# EAGLE design nanino (EAGLE 6.2)
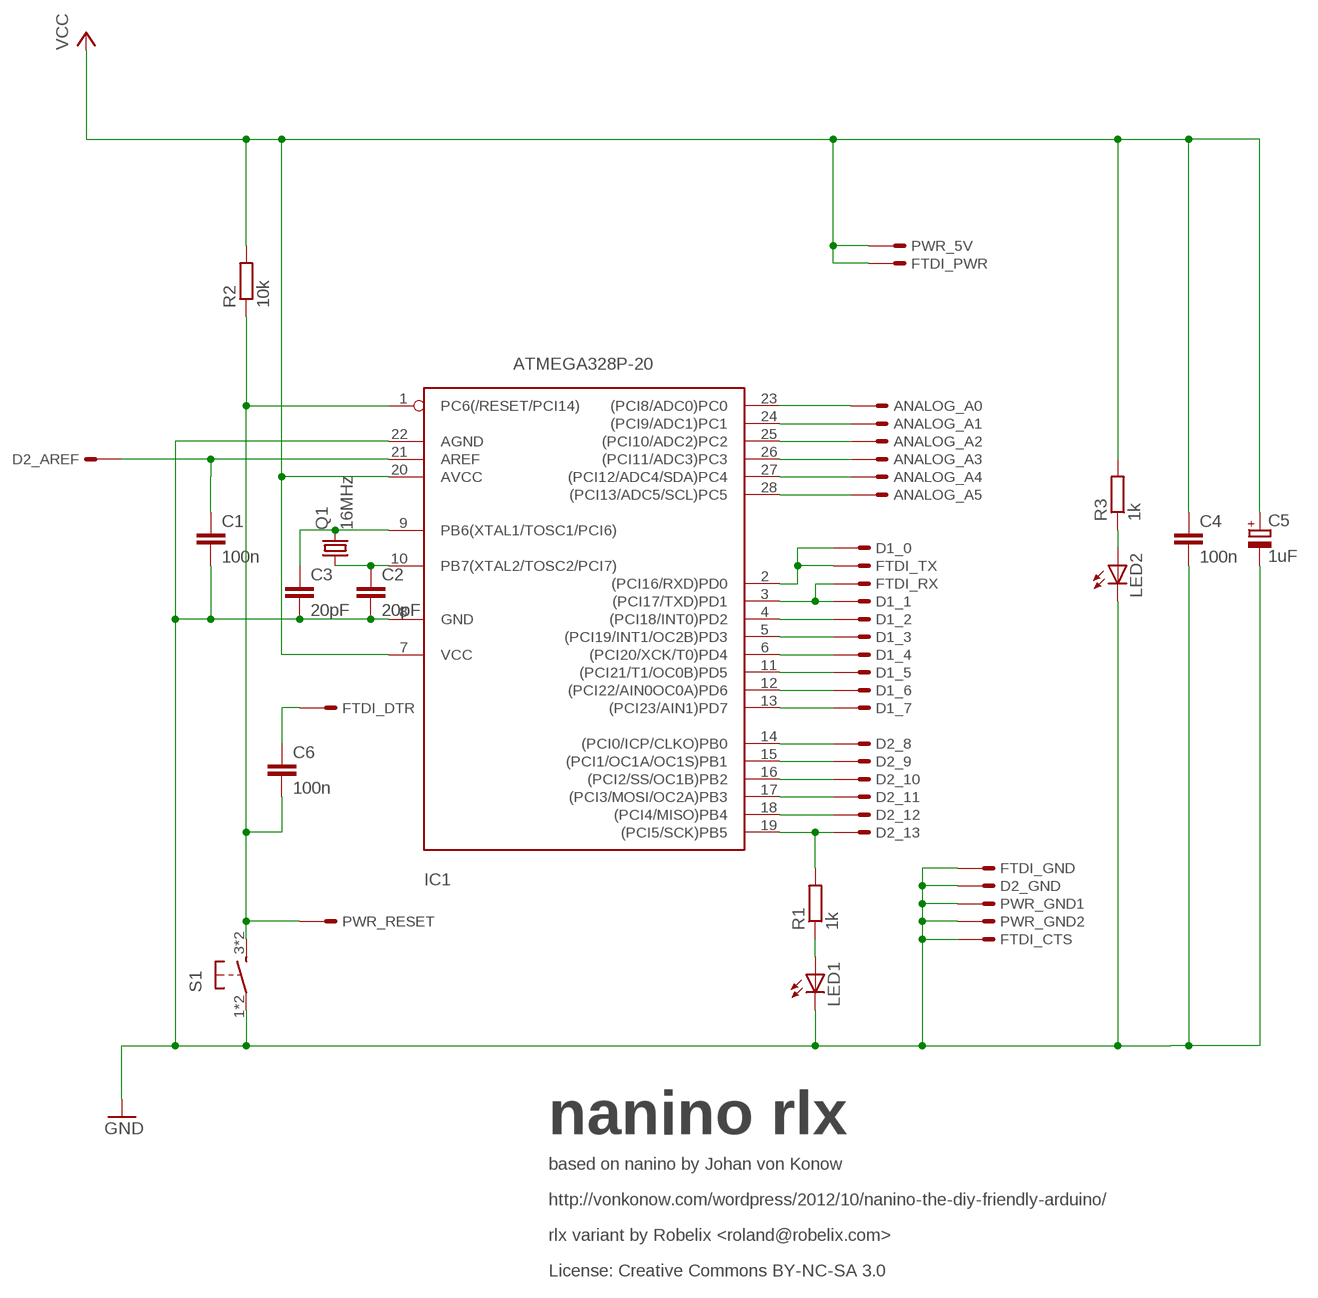
[diagram p0: schematic, sheet 1]

## Parts
ANALOG_  PINS_ARDUINO_ANALOG1  [6PIN]
C1  100n  C-EU025-025X050  [C025-025X050]
C2  20pF  C-EU025-025X050  [C025-025X050]
C3  20pF  C-EU025-025X050  [C025-025X050]
C4  100n  C-EU025-025X050  [C025-025X050]
C5  1uF  CPOL-EUE2.5-5-L-12  [E2,5-5-L-12]
C6  100n  C-EU050-025X075  [C050-025X075]
D1_  PINS_ARDUINO_DIGITAL1  [8PIN]
D2_  PINS_ARDUINO_DIGITAL2  [8PIN]
FTDI_  PINS_FTDI1  [6PIN]
IC1  ATMEGA328P-20  [DIL28-3]
LED1  LED3MM  [LED3MM]
LED2  LED3MM  [LED3MM]
PWR_  PINS_ARDUINO_PWR1  [6PIN]
Q1  16MHz  CRYSTALHC49U-V  [HC49U-V]
R1  1k  R-EU_0207/10  [0207/10]
R2  10k  R-EU_0207/10  [0207/10]
R3  1k  R-EU_0207/10  [0207/10]
S1  TASTER4.3MM  [TASTER6X6]

## Nets
GND: C1.2 C2.2 C3.2 C4.2 C5.- D2_.7 FTDI_.1 FTDI_.2 IC1.8(GND) IC1.22(AGND) LED1.K(C) LED2.K(C) PWR_.4 PWR_.5 S1.1 S1.2
N$1: D1_.1 FTDI_.4 IC1.2((PCI16/RXD)PD0)
N$2: D1_.2 FTDI_.5 IC1.3((PCI17/TXD)PD1)
N$3: D1_.3 IC1.4((PCI18/INT0)PD2)
N$4: D1_.4 IC1.5((PCI19/INT1/OC2B)PD3)
N$5: D1_.5 IC1.6((PCI20/XCK/T0)PD4)
N$6: D1_.6 IC1.11((PCI21/T1/OC0B)PD5)
N$7: D1_.7 IC1.12((PCI22/AIN0OC0A)PD6)
N$8: D1_.8 IC1.13((PCI23/AIN1)PD7)
N$9: D2_.1 IC1.14((PCI0/ICP/CLKO)PB0)
N$10: D2_.2 IC1.15((PCI1/OC1A/OC1S)PB1)
N$11: D2_.3 IC1.16((PCI2/SS/OC1B)PB2)
N$12: D2_.4 IC1.17((PCI3/MOSI/OC2A)PB3)
N$13: D2_.5 IC1.18((PCI4/MISO)PB4)
N$14: D2_.6 IC1.19((PCI5/SCK)PB5) R1.2
N$15: LED1.A R1.1
N$17: ANALOG_.6 IC1.23((PCI8/ADC0)PC0)
N$18: ANALOG_.5 IC1.24((PCI9/ADC1)PC1)
N$19: ANALOG_.4 IC1.25((PCI10/ADC2)PC2)
N$20: ANALOG_.3 IC1.26((PCI11/ADC3)PC3)
N$21: ANALOG_.2 IC1.27((PCI12/ADC4/SDA)PC4)
N$22: ANALOG_.1 IC1.28((PCI13/ADC5/SCL)PC5)
N$24: C6.2 IC1.1(PC6(/RESET/PCI14)) PWR_.1 R2.1 S1.3 S1.4
N$25: LED2.A R3.1
N$28: C1.1 D2_.8 IC1.21(AREF)
N$29: C3.1 IC1.9(PB6(XTAL1/TOSC1/PCI6)) Q1.2
N$30: C2.1 IC1.10(PB7(XTAL2/TOSC2/PCI7)) Q1.1
N$33: C6.1 FTDI_.6
VCC: C4.1 C5.+ FTDI_.3 IC1.7(VCC) IC1.20(AVCC) PWR_.3 R2.2 R3.2
Unconnected: PWR_.2 PWR_.6

## Notes on the sheet
- nanino rlx
- based on nanino by Johan von Konow
- http://vonkonow.com/wordpress/2012/10/nanino-the-diy-friendly-arduino/
- rlx variant by Robelix <roland@robelix.com>
- License: Creative Commons BY-NC-SA 3.0

## Library data of the parts
ANALOG_ = arduino:PINS_ARDUINO_ANALOG
C1-C4 C6 = rc:C-EU: CAPACITOR, European symbol
C5 = elkos:CPOL-EU: POLARIZED CAPACITOR, European symbol
D1_ = arduino:PINS_ARDUINO_DIGITAL1
D2_ = arduino:PINS_ARDUINO_DIGITAL2
FTDI_ = arduino:PINS_FTDI
IC1 = atmel:ATMEGA328P
LED1 LED2 = leds:LED: LED OSRAM: - CHIPLED LG R971, LG N971, LY N971, LG Q971, LY Q971, LO R971, LY R971 LH N974, LH R974 LS Q976, LO Q976, LY Q976 LO Q996 - Hyper CHIPLED LW Q18S LB Q993, LB Q99A, LB R99A - SideLED LS A670, LO A670, LY A670, LG A670, LP A670 LB A673, LV A673, LT A673, LW A673 LH A674 LY A675 LS A676, LA A676, LO A676, LY A676, LW A676 LS A679, LY A679, LG A679 - Hyper Micro SIDELED® LS Y876, LA Y876, LO Y876, LY Y876 LT Y87S - SmartLED LW L88C, LW L88S LB L89C, LB L89S, LG L890 LS L89K, LO L89K, LY L89K LS L896, LA L896, LO L896, LY L896 - TOPLED LS T670, LO T670, LY T670, LG T670, LP T670 LSG T670, LSP T670, LSY T670, LOP T670, LYG T670 LG T671, LOG T671, LSG T671 LB T673, LV T673, LT T673, LW T673 LH T674 LS T676, LA T676, LO T676, LY T676, LB T676, LH T676, LSB T676, LW T676 LB T67C, LV T67C, LT T67C, LS T67K, LO T67K, LY T67K, LW E67C LS E67B, LA E67B, LO E67B, LY E67B, LB E67C, LV E67C, LT E67C LW T67C LS T679, LY T679, LG T679 LS T770, LO T770, LY T770, LG T770, LP T770 LB T773, LV T773, LT T773, LW T773 LH T774 LS E675, LA E675, LY E675, LS T675 LS T776, LA T776, LO T776, LY T776, LB T776 LHGB T686 LT T68C, LB T68C - Hyper Mini TOPLED® LB M676 - Mini TOPLED Santana® LG M470 LS M47K, LO M47K, LY M47K Source: http://www.osram.convergy.de LUXEON: - LUMILED® LXK2-PW12-R00, LXK2-PW12-S00, LXK2-PW14-U00, LXK2-PW14-V00 LXK2-PM12-R00, LXK2-PM12-S00, LXK2-PM14-U00 LXK2-PE12-Q00, LXK2-PE12-R00, LXK2-PE12-S00, LXK2-PE14-T00, LXK2-PE14-U00 LXK2-PB12-K00, LXK2-PB12-L00, LXK2-PB12-M00, LXK2-PB14-N00, LXK2-PB14-P00, LXK2-PB14-Q00 LXK2-PR12-L00, LXK2-PR12-M00, LXK2-PR14-Q00, LXK2-PR14-R00 LXK2-PD12-Q00, LXK2-PD12-R00, LXK2-PD12-S00 LXK2-PH12-R00, LXK2-PH12-S00 LXK2-PL12-P00, LXK2-PL12-Q00, LXK2-PL12-R00 Source: www.luxeon.com KINGBRIGHT: KA-3528ASYC Source: www.kingbright.com
PWR_ = arduino:PINS_ARDUINO_PWR
Q1 = crystals:CRYSTAL: CRYSTAL; OC_FARNELL: 1666969; OC_NEWARK: unknown
R1-R3 = rc:R-EU_: RESISTOR, European symbol
S1 = switch:TASTER: Kurzhubtaster vertikale Betätigung, 6x6 mm; REICHELT: TASTER 3301

## Board
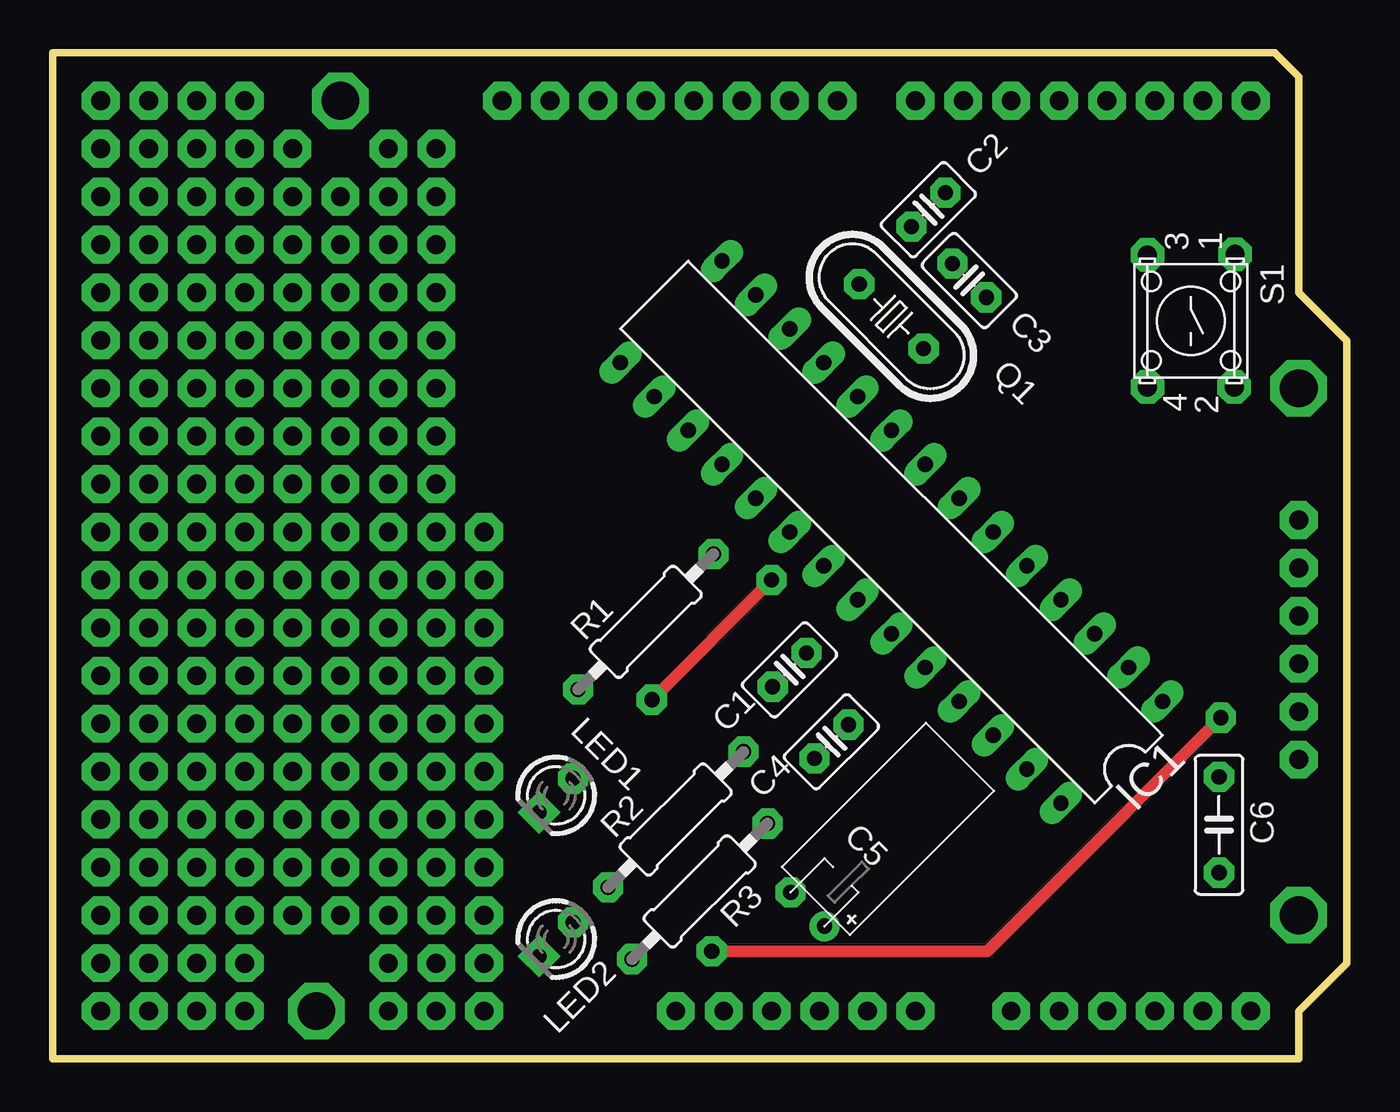
[diagram p1: board, top side]
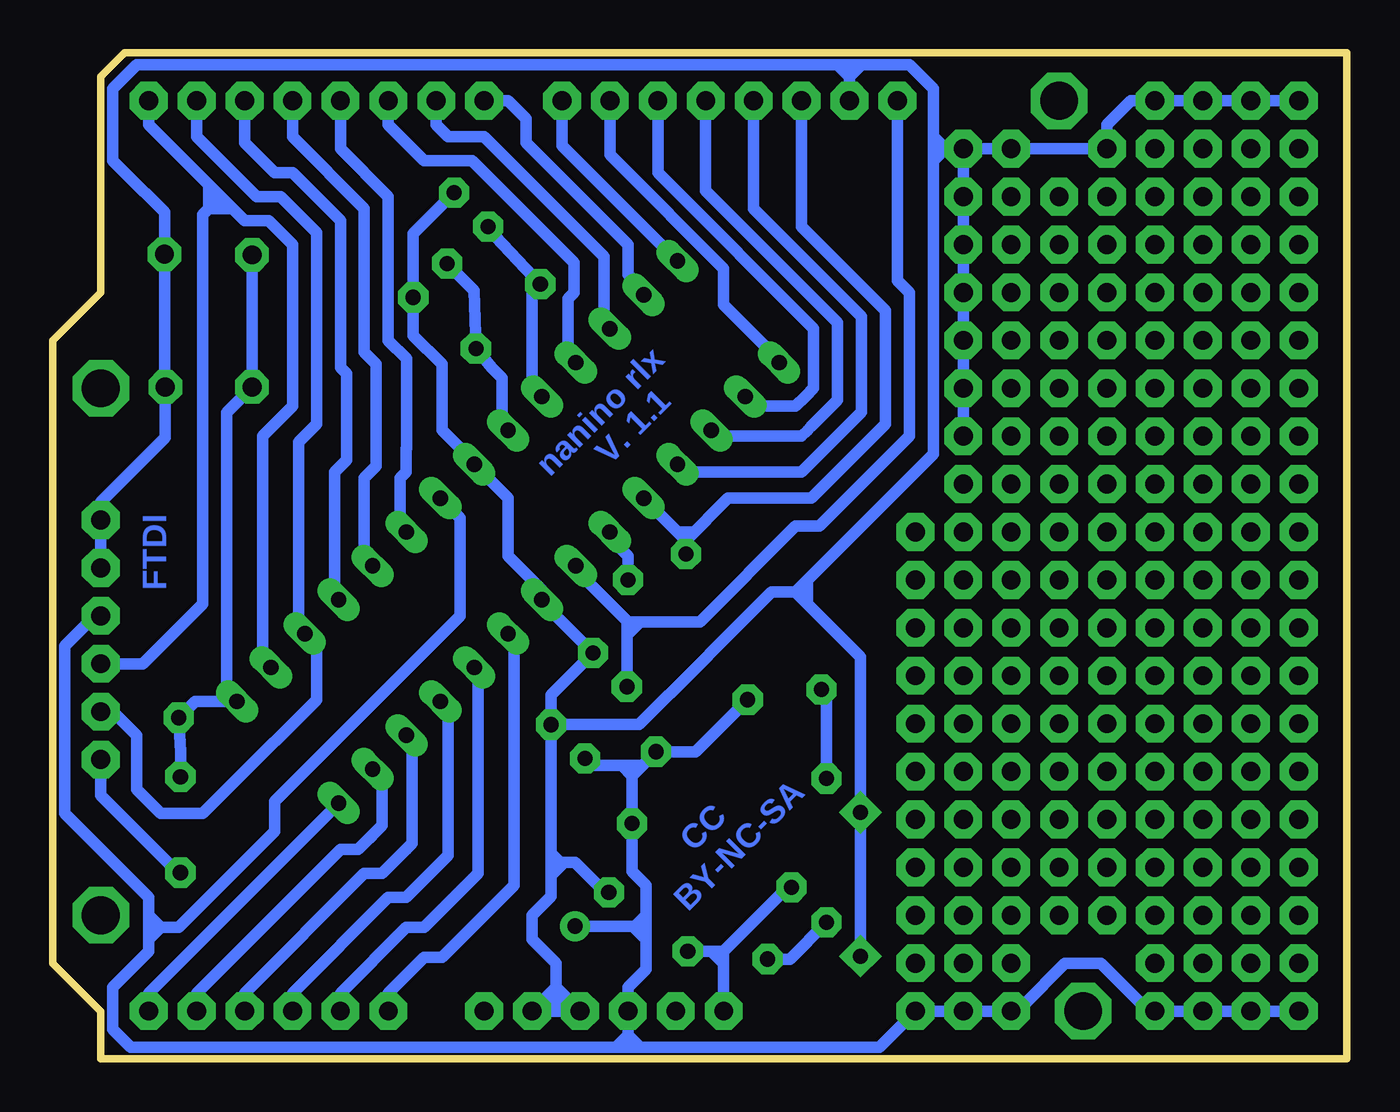
[diagram p2: board, bottom side, seen from below]

Size 68.58 x 53.34 mm. Coordinates in mm from the lower left corner, seen from the top.
Outline: 0,53.34 0,0 66.04,0 66.04,2.54 68.58,5.08 68.58,38.1 66.04,40.64 66.04,52.07 64.77,53.34 0,53.34
Copper layers (1*16): Top 0.035mm / dielectric 1.5mm / Bottom 0.035mm
Design rules "default": minimum track width 10mil, minimum drill 24mil, track to track 8mil, track to pad 8mil, pad to pad 8mil, via to via 8mil, smd to smd 8mil, copper to edge 40mil, drill to drill 8mil, minimum pad ring 10mil, minimum via ring 8mil, stop-mask expansion 4mil, vias tented up to drill 0mil, thermal gap 10mil

### Footprints (pad centres in the part's own frame; a part is rotated, then mirrored left to right if it is on the bottom)
6PIN = drill 1 pad 2 octagon: 1 -6.35,-1.27; 2 -3.81,-1.27; 3 -1.27,-1.27; 4 1.27,-1.27; 5 3.81,-1.27; 6 6.35,-1.27
C025-025X050 = drill 0.8 pad 1.6 octagon: 1 -1.27,0; 2 1.27,0
E2,5-5-L-12 = drill 0.813 pad 1.6: + -1.27,0 | drill 0.813 pad 1.6 octagon: - 1.27,0
C050-025X075 = drill 0.8 pad 1.6 octagon: 1 -2.54,0; 2 2.54,0
8PIN = drill 1 pad 2 octagon: 1 -8.89,-1.27; 2 -6.35,-1.27; 3 -3.81,-1.27; 4 -1.27,-1.27; 5 1.27,-1.27; 6 3.81,-1.27; 7 6.35,-1.27; 8 8.89,-1.27
DIL28-3 = drill 0.813 long: 1 -16.51,-3.81; 2 -13.97,-3.81; 3 -11.43,-3.81; 4 -8.89,-3.81; 5 -6.35,-3.81; 6 -3.81,-3.81; 7 -1.27,-3.81; 8 1.27,-3.81; 9 3.81,-3.81; 10 6.35,-3.81; 11 8.89,-3.81; 12 11.43,-3.81; 13 13.97,-3.81; 14 16.51,-3.81; 15 16.51,3.81; 16 13.97,3.81; 17 11.43,3.81; 18 8.89,3.81; 19 6.35,3.81; 20 3.81,3.81; 21 1.27,3.81; 22 -1.27,3.81; 23 -3.81,3.81; 24 -6.35,3.81; 25 -8.89,3.81; 26 -11.43,3.81; 27 -13.97,3.81; 28 -16.51,3.81
LED3MM = drill 0.8 pad 1.6 octagon: A -1.27,0 | drill 0.8 pad 1.6 square: K 1.27,0
HC49U-V = drill 0.8 pad 1.6 octagon: 1 -2.413,0; 2 2.413,0
0207/10 = drill 0.8 pad 1.6 octagon: 1 -5.08,0; 2 5.08,0
TASTER6X6 = drill 1 pad 1.778 octagon: 1 -3.54,2.34; 2 3.5,2.3; 3 -3.5,-2.3; 4 3.5,-2.3

### Placement (x,y rotation side)
ANALOG_  57.15,1.27 180 top
C1  39.05,20.64 45 top
C2  46.41,45.03 45 top
C3  48.58,41.27 315 top
C4  41.27,16.83 45 top
C5  40.01,7.94 135 top
C6  61.82,12.42 90 top
D1_  54.61,49.53 180 top
D2_  32.7,49.53 180 top
FTDI_  67.31,22.23 270 top
IC1  44.45,27.94 135 top
LED1  26.67,13.97 225 top
LED2  26.67,6.35 225 top
PWR_  39.37,3.81 0 top
Q1  44.45,39.37 315 top
R1  31.43,23.18 45 top
R2  33.02,12.7 45 top
R3  34.29,8.89 45 top
S1  60.33,39.13 270 top

### Tracks (layer width: path | path; a pad name or v marks a point on that pad's centre or on a via)
GND  (via drill 1 pad 2)
  Bottom 0.61: LED2.K LED1.K 25.77,21.33 26.35,21.91 28.26,23.81 | 26.99,52.7 27.94,52.7 49.21,52.7 64.14,52.7 65.41,51.44 65.41,47.62 64.77,46.99 62.66,44.88 S1.1 62.66,35.67 S1.2 62.62,32.94 63.18,32.38 66.04,29.53 FTDI_.1 FTDI_.2 | 26.99,52.7 26.35,52.7 | 26.35,52.7 25.72,52.7 | 25.72,52.7 23.18,52.7 21.91,51.44 21.91,48.9 | 21.91,48.9 21.91,48.26 | 21.91,48.26 21.91,47.62 | 21.91,47.62 21.91,46.35 21.91,45.72 21.91,45.09 21.91,36.2 | 21.91,36.2 21.91,35.56 21.91,34.92 | 26.35,51.12 D2_.7 26.35,52.07 | 21.91,34.92 21.91,34.61 | 21.91,34.61 21.91,32.07 26.67,27.3 | C2.2 49.48,43.76 C3.2 49.48,38.68 49.48,38.36 47.94,36.83 47.94,33.34 47.62,33.02 46.67,32.07 46.25,31.64 IC1.8 44.45,29.74 44.45,26.67 42.65,24.87 IC1.22 42.65,24.24 C1.2 42.17,19.31 C4.2 | C4.2 37.52,17.73 34.29,20.95 33.34,21.91 30.48,24.77 29.21,24.77 | C4.2 42.17,10.42 | 28.26,23.81 28.57,24.13 | 28.57,24.13 29.21,24.77 | 26.35,52.07 26.35,52.7 | 26.35,52.7 25.72,52.7 | 25.72,52.7 26.35,52.07 | 26.35,52.07 26.99,52.7 | 26.99,26.99 26.67,27.3 | 28.26,23.81 28.57,24.13 | 28.57,24.13 29.21,24.77 | 26.67,27.3 28.57,25.4 | 28.57,25.4 29.21,24.77 | 28.57,24.13 28.57,25.08 28.57,25.4 | v20.32,35.56 v20.32,38.1 v20.32,40.64 v20.32,43.18 v20.32,45.72 | v2.54,50.8 v5.08,50.8 v7.62,50.8 v10.16,50.8 11.43,50.8 12.7,49.53 12.7,48.26 17.78,48.26 20.32,48.26 | 21.91,36.2 21.91,34.92 | 21.91,34.92 21.91,34.61 | 41.91,3.81 41.91,3.49 41.91,3.17 | 41.91,3.17 41.27,2.54 PWR_.4 | PWR_.4 42.55,2.54 | 42.55,2.54 PWR_.5 | 41.91,3.17 42.55,2.54 | 42.55,2.54 42.55,2.86 42.86,3.17 42.55,3.17 | 42.55,3.17 40.96,3.17 40.96,2.86 PWR_.4 | PWR_.4 41.91,3.81 | 41.91,3.81 42.55,3.17
  Bottom 0.61: v20.32,35.56 v20.32,45.72 | v20.32,33.02 v20.32,35.56 | v20.32,45.72 20.32,48.26 | v20.32,45.72 20.32,48.26 | 20.32,48.26 21.27,48.26 | 21.27,48.26 21.91,48.26 | 21.91,48.9 21.27,48.26 | 21.27,48.26 21.91,47.62 | C5.- 39.32,8.84 40.64,10.16 40.9,10.42 42.17,10.42 | 41.91,3.81 41.91,5.08 43.18,6.35 43.18,7.62 42.17,8.63 42.17,9.15 42.17,10.42
N$1
  Bottom 0.61: 56.52,43.81 57.15,44.45 | 57.15,44.45 55.88,43.18 55.88,34.61 57.47,33.02 57.47,32.7 57.47,21.59 57.47,21.27 57.02,20.83 IC1.2 | 60.33,45.09 60.64,44.77 60.64,38.42 60.64,29.84 60.64,25.72 60.64,24.13 63.82,20.95 65.41,20.95 FTDI_.4 | 60.33,45.09 59.69,45.72 | D1_.1 63.5,49.85 63.5,49.53 60.33,46.35 | 60.33,46.35 59.69,45.72 | 59.69,45.72 59.05,45.09 | 59.05,45.09 58.74,44.77 58.42,44.45 57.15,44.45 | 59.05,45.09 60.33,45.09 | 60.33,45.09 60.33,46.35
N$2
  Bottom 0.61: D1_.2 60.96,49.85 60.96,48.9 57.78,45.72 56.52,45.72 54.61,43.81 54.61,33.66 55.56,32.7 55.56,23.18 55.23,22.84 IC1.3 55.57,22.55 54.61,21.59 54.61,19.05 59.05,14.61 60.33,13.34 60.64,13.02 62.87,13.02 | FTDI_.5 65.41,18.41 64.77,17.78 64.45,17.46 64.14,17.14 64.14,14.29 | 64.14,14.29 62.87,13.02 | 62.87,13.02 64.14,14.29
N$3
  Bottom 0.61: IC1.4 53.43,24.54 53.66,24.77 53.66,31.11 53.02,31.75 53.02,36.33 53.34,36.65 53.34,36.83 53.34,44.45 55.88,46.99 56.83,46.99 58.42,48.58 D1_.3
N$4
  Bottom 0.61: IC1.5 51.63,26.23 51.95,26.23 52.07,26.35 52.07,30.8 51.44,31.43 51.44,36.83 51.91,37.31 | 51.91,37.31 52.07,37.47 52.07,44.77 52.07,45.09 55.88,48.9 D1_.4 | 51.91,37.31 51.75,37.15 51.63,37.03
N$5
  Bottom 0.61: IC1.6 50.16,28.26 50.16,30.8 49.85,31.11 49.85,32.37 49.84,32.38 49.84,37.14 50.8,38.1 50.8,45.72 53.34,48.26 D1_.5
N$6
  Bottom 0.61: IC1.11 41.05,36.92 41.27,37.15 41.27,40.32 40.96,40.64 40.96,42.03 40.96,42.23 41.91,43.18 46.35,47.62 48.9,47.62 50.8,49.53 D1_.6
N$7
  Bottom 0.61: 46.35,48.9 45.72,48.9 | 45.72,48.9 39.37,42.55 39.37,39.05 39.06,38.74 IC1.12 | 45.72,48.9 47.31,48.9 47.62,48.9 48.26,49.53 D1_.7
N$8
  Bottom 0.61: IC1.13 37.34,40.51 37.47,40.64 37.47,40.96 38.1,41.59 38.1,43.18 42.86,47.94 43.18,48.26 43.5,48.58 43.5,49.85 | D1_.8 44.77,50.8 44.45,50.8 43.81,50.16 | 43.81,50.16 43.5,49.85 | 43.5,49.85 43.81,50.16
N$9
  Bottom 0.61: IC1.14 41.59,48.43 D2_.1
N$10
  Bottom 0.61: IC1.15 30.08,37.07 33.02,40.01 33.02,41.91 38.73,47.62 39.05,47.94 D2_.2
N$11
  Bottom 0.61: 36.51,46.99 36.2,46.67 | 36.2,46.67 28.26,38.73 28.26,35.56 28.69,35.12 29.21,34.61 31.43,34.61 31.88,35.05 IC1.16 | D2_.3 36.51,46.99 | 36.51,46.99 36.2,46.67
N$12
  Bottom 0.61: D2_.4 33.97,46.04 27.3,39.37 26.99,39.05 26.99,34.92 28.42,33.5 28.58,33.33 28.89,33.02 33.34,33.02 33.65,33.33 IC1.17
N$13
  Bottom 0.61: D2_.5 31.43,45.09 26.04,39.69 25.72,39.37 25.72,34.29 27.62,32.38 28.1,31.91 28.48,31.53 28.89,31.11 34.92,31.11 35.34,31.53 IC1.18
N$14
  Bottom 0.61: D2_.6 28.89,44.13 24.45,39.69 24.45,33.66 25.72,32.38 27.78,30.32 28.37,29.74 32.78,29.74 35.02,27.5 | R1.2 35.02,27.5 | 35.02,27.5 IC1.19
N$15
  Bottom 0.61: LED1.A 27.57,19.31 R1.1
N$16  (via drill 2 pad 2.54)
  other vias: 15.24,50.8
N$17
  Bottom 0.61: 44.45,8.89 47.62,5.71 47.94,5.4 48.9,5.4 50.8,3.49 ANALOG_.6 | 44.45,8.89 | 44.45,8.89 44.13,9.21 44.13,22.23 IC1.23
N$18
  Bottom 0.61: 46.25,9.63 46.35,9.53 | 46.35,9.53 46.99,8.89 48.58,7.3 48.9,6.99 49.85,6.99 53.34,3.49 ANALOG_.5 | 46.35,9.53 46.04,9.84 46.04,20.32 46.25,20.53 IC1.24
N$19
  Bottom 0.61: 48.26,10.16 48.04,10.38 48.26,10.16 | 48.26,10.16 49.53,8.89 | 48.26,10.16 49.53,8.89 | 48.26,10.16 47.62,10.79 47.62,18.73 47.85,18.96 IC1.25 | ANALOG_.4 55.88,3.49 50.8,8.57 49.85,8.57 49.53,8.89
N$20
  Bottom 0.61: 49.84,11.12 50.16,10.79 | 50.16,10.79 50.8,10.16 51.12,9.84 52.07,9.84 58.42,3.49 ANALOG_.3 | 50.16,10.79 49.53,11.43 49.53,16.83 49.84,17.14 IC1.26
N$21
  Bottom 0.61: 51.63,11.87 52.07,11.43 | 52.07,11.43 51.44,12.06 51.12,12.38 51.12,14.92 51.56,15.37 IC1.27 | ANALOG_.2 60.96,3.49 53.34,11.11 52.39,11.11 52.07,11.43
N$22
  Bottom 0.61: 63.5,2.72 ANALOG_.1 63.5,3.17 63.5,3.49 54.29,12.7 54.29,12.71 IC1.28
N$23  (via drill 2 pad 2.54)
  other vias: 66.04,35.56
N$24  (via drill 0.8 pad 1.6)
  Top 0.61: v34.92,5.71 49.53,5.71 52.07,8.26 v61.91,18.1
  Bottom 0.61: 33.02,5.08 PWR_.1 | 58.82,34.84 S1.4 | S1.3 S1.4 | v34.92,5.71 33.97,5.71 | 33.97,5.71 33.66,5.71 33.34,5.4 | 33.34,5.4 33.02,5.08 | S1.4 59.37,34.28 59.37,19.51 IC1.1 61.05,18.96 v61.91,18.1 61.82,16.29 C6.2 | R2.1 29.63,9.11 33.02,5.71 | 33.02,5.71 33.34,5.4 | 33.97,5.71 33.02,5.71 | 33.02,5.71 33.02,5.08
N$25
  Bottom 0.61: R3.1 29.52,5.3 LED2.A
N$26  (via drill 2 pad 2.54)
  other vias: 13.97,2.54
N$27  (via drill 2 pad 2.54)
  other vias: 66.04,7.62
N$28
  Bottom 0.61: IC1.21 40.86,25.93 38.58,23.65 | 38.58,23.65 38.1,23.18 | 38.1,23.18 37.94,23.02 | 37.47,23.18 34.29,23.18 29.21,28.26 27.94,28.26 27.3,28.89 25.08,31.11 23.18,33.02 23.18,33.66 23.18,40.64 23.81,41.27 D2_.8 | 37.47,23.18 38.1,23.18 | C1.1 38.15,22.81 38.15,23.23 38.58,23.65 | 37.47,23.18 38.1,22.54
N$29
  Bottom 0.61: C3.1 46.25,40.74 Q1.2 45.29,36.62 44.77,36.09 44.77,33.66 IC1.9
N$30
  Bottom 0.61: C2.1 45.51,44.02 Q1.1 43.18,40.64 43.18,35.56 42.74,35.12 IC1.10
N$31  (via drill 1 pad 2)
  other vias: 7.62,48.26
N$32  (via drill 1 pad 2)
  other vias: 10.16,48.26
N$33
  Bottom 0.61: FTDI_.6 66.04,13.97 61.95,9.88 C6.1
N$35  (via drill 1 pad 2)
  other vias: 2.54,48.26
N$36
  Bottom 0.61: 34.61,27.94 35.24,27.94
N$37  (via drill 1 pad 2)
  other vias: 5.08,48.26
N$38  (via drill 1 pad 2)
  other vias: 10.16,45.72
N$39  (via drill 1 pad 2)
  Bottom 0.61: v12.7,48.26 v17.78,48.26 v20.32,48.26
N$40  (via drill 1 pad 2)
  other vias: 12.7,45.72
N$41  (via drill 1 pad 2)
  other vias: 15.24,45.72
N$42  (4 unrouted)
  Bottom 0.305: 64.77,53.34 66.04,52.07 66.04,49.53 | 66.04,40.64 66.04,41.91 66.04,40.64 | 0,53.34 1.27,53.34 | 64.77,53.34 62.23,53.34 64.77,53.34 | 68.58,38.1 68.58,36.83 68.58,38.1 | 68.58,5.08 68.58,6.35 68.58,5.08 | 66.04,40.64 68.58,38.1 | 66.04,2.54 66.04,0 | 66.04,0 63.5,0 66.04,0 | 0,0 2.54,0 0,0 | 68.58,5.08 66.04,2.54 | 66.04,2.54 66.04,0 | 0,2.54 0,0 | 0,50.8 0,53.34 | 0,53.34 2.54,53.34
N$43  (via drill 1 pad 2)
  other vias: 17.78,45.72
N$44  (via drill 1 pad 2)
  other vias: 2.54,45.72
N$45  (via drill 1 pad 2)
  other vias: 5.08,45.72
N$46  (via drill 1 pad 2)
  other vias: 7.62,45.72
N$47  (via drill 1 pad 2)
  other vias: 20.32,30.48
N$48  (via drill 1 pad 2)
  other vias: 20.32,27.94
N$49  (via drill 1 pad 2)
  other vias: 22.86,17.78
N$50  (via drill 1 pad 2)
  other vias: 22.86,20.32
N$51  (via drill 1 pad 2)
  other vias: 22.86,22.86
N$52  (via drill 1 pad 2)
  other vias: 22.86,25.4
N$53  (via drill 1 pad 2)
  other vias: 22.86,27.94
N$54  (via drill 1 pad 2)
  other vias: 5.08,27.94
N$55  (via drill 1 pad 2)
  other vias: 2.54,27.94
N$56  (via drill 1 pad 2)
  other vias: 2.54,25.4
N$57  (via drill 1 pad 2)
  other vias: 17.78,43.18
N$58  (via drill 1 pad 2)
  other vias: 15.24,43.18
N$59  (via drill 1 pad 2)
  other vias: 12.7,43.18
N$60  (via drill 1 pad 2)
  other vias: 10.16,43.18
N$61  (via drill 1 pad 2)
  other vias: 7.62,43.18
N$62  (via drill 1 pad 2)
  other vias: 5.08,43.18
N$63  (via drill 1 pad 2)
  other vias: 2.54,43.18
N$64  (via drill 1 pad 2)
  other vias: 2.54,40.64
N$65  (via drill 1 pad 2)
  other vias: 5.08,40.64
N$66  (via drill 1 pad 2)
  other vias: 7.62,40.64
N$67  (via drill 1 pad 2)
  other vias: 10.16,40.64
N$68  (via drill 1 pad 2)
  other vias: 12.7,40.64
N$69  (via drill 1 pad 2)
  other vias: 15.24,40.64
N$70  (via drill 1 pad 2)
  other vias: 17.78,40.64
N$71  (via drill 1 pad 2)
  other vias: 2.54,22.86
N$72  (via drill 1 pad 2)
  other vias: 2.54,20.32
N$73  (via drill 1 pad 2)
  other vias: 17.78,38.1
N$74  (via drill 1 pad 2)
  other vias: 15.24,38.1
N$75  (via drill 1 pad 2)
  other vias: 12.7,38.1
N$76  (via drill 1 pad 2)
  other vias: 10.16,38.1
N$77  (via drill 1 pad 2)
  other vias: 7.62,38.1
N$78  (via drill 1 pad 2)
  other vias: 5.08,38.1
N$79  (via drill 1 pad 2)
  other vias: 2.54,38.1
N$80  (via drill 1 pad 2)
  other vias: 2.54,35.56
N$81  (via drill 1 pad 2)
  other vias: 5.08,35.56
N$82  (via drill 1 pad 2)
  other vias: 7.62,35.56
N$83  (via drill 1 pad 2)
  other vias: 10.16,35.56
N$84  (via drill 1 pad 2)
  other vias: 12.7,35.56
N$85  (via drill 1 pad 2)
  other vias: 15.24,35.56
N$86  (via drill 1 pad 2)
  other vias: 17.78,35.56
N$87  (via drill 1 pad 2)
  other vias: 2.54,17.78
N$88  (via drill 1 pad 2)
  other vias: 2.54,15.24
N$89  (via drill 1 pad 2)
  other vias: 17.78,33.02
N$90  (via drill 1 pad 2)
  other vias: 15.24,33.02
N$91  (via drill 1 pad 2)
  other vias: 12.7,33.02
N$92  (via drill 1 pad 2)
  other vias: 10.16,33.02
N$93  (via drill 1 pad 2)
  other vias: 7.62,33.02
N$94  (via drill 1 pad 2)
  other vias: 5.08,33.02
N$95  (via drill 1 pad 2)
  other vias: 2.54,33.02
N$96  (via drill 1 pad 2)
  other vias: 2.54,30.48
N$97  (via drill 1 pad 2)
  other vias: 5.08,30.48
N$98  (via drill 1 pad 2)
  other vias: 7.62,30.48
N$99  (via drill 1 pad 2)
  other vias: 10.16,30.48
N$100  (via drill 1 pad 2)
  other vias: 12.7,30.48
N$101  (via drill 1 pad 2)
  other vias: 15.24,30.48
N$102  (via drill 1 pad 2)
  other vias: 17.78,30.48
N$103  (via drill 1 pad 2)
  other vias: 2.54,12.7
N$104  (via drill 1 pad 2)
  other vias: 2.54,10.16
N$105  (via drill 1 pad 2)
  other vias: 2.54,7.62
N$106  (via drill 1 pad 2)
  other vias: 17.78,27.94
N$107  (via drill 1 pad 2)
  other vias: 15.24,27.94
N$108  (via drill 1 pad 2)
  other vias: 12.7,27.94
N$109  (via drill 1 pad 2)
  other vias: 10.16,27.94
N$110  (via drill 1 pad 2)
  other vias: 7.62,27.94
N$111  (via drill 1 pad 2)
  other vias: 2.54,5.08
N$112
  Bottom 0.406: 41.59,10.48 42.23,11.11 42.23,9.53 41.27,10.48
N$114  (via drill 1 pad 2)
  other vias: 5.08,25.4
N$115  (via drill 1 pad 2)
  other vias: 7.62,25.4
N$116  (via drill 1 pad 2)
  other vias: 10.16,25.4
N$117  (via drill 1 pad 2)
  other vias: 12.7,25.4
N$118  (via drill 1 pad 2)
  other vias: 15.24,25.4
N$119  (via drill 1 pad 2)
  other vias: 17.78,25.4
N$120  (via drill 1 pad 2)
  other vias: 20.32,25.4
N$125  (via drill 1 pad 2)
  other vias: 20.32,22.86
N$126  (via drill 1 pad 2)
  other vias: 17.78,22.86
N$127  (via drill 1 pad 2)
  other vias: 15.24,22.86
N$128  (via drill 1 pad 2)
  other vias: 12.7,22.86
N$129  (via drill 1 pad 2)
  other vias: 10.16,22.86
N$130  (via drill 1 pad 2)
  other vias: 7.62,22.86
N$131  (via drill 1 pad 2)
  other vias: 5.08,22.86
N$134  (via drill 1 pad 2)
  other vias: 5.08,20.32
N$135  (via drill 1 pad 2)
  other vias: 7.62,20.32
N$136  (via drill 1 pad 2)
  other vias: 10.16,20.32
N$137  (via drill 1 pad 2)
  other vias: 12.7,20.32
N$138  (via drill 1 pad 2)
  other vias: 15.24,20.32
N$139  (via drill 1 pad 2)
  other vias: 17.78,20.32
N$140  (via drill 1 pad 2)
  other vias: 20.32,20.32
N$144  (via drill 1 pad 2)
  other vias: 20.32,17.78
N$145  (via drill 1 pad 2)
  other vias: 17.78,17.78
N$146  (via drill 1 pad 2)
  other vias: 15.24,17.78
N$148  (via drill 1 pad 2)
  other vias: 12.7,17.78
N$149  (via drill 1 pad 2)
  other vias: 10.16,17.78
N$150  (via drill 1 pad 2)
  other vias: 7.62,17.78
N$151  (via drill 1 pad 2)
  other vias: 5.08,17.78
N$154  (via drill 1 pad 2)
  other vias: 5.08,15.24
N$155  (via drill 1 pad 2)
  other vias: 7.62,15.24
N$156  (via drill 1 pad 2)
  other vias: 10.16,15.24
N$157  (via drill 1 pad 2)
  other vias: 12.7,15.24
N$158  (via drill 1 pad 2)
  other vias: 15.24,15.24
N$159  (via drill 1 pad 2)
  other vias: 17.78,15.24
N$160  (via drill 1 pad 2)
  other vias: 20.32,15.24
N$161  (via drill 1 pad 2)
  other vias: 22.86,15.24
N$162  (via drill 1 pad 2)
  other vias: 22.86,12.7
N$163  (via drill 1 pad 2)
  other vias: 20.32,12.7
N$164  (via drill 1 pad 2)
  other vias: 17.78,12.7
N$165  (via drill 1 pad 2)
  other vias: 15.24,12.7
N$166  (via drill 1 pad 2)
  other vias: 12.7,12.7
N$167  (via drill 1 pad 2)
  other vias: 10.16,12.7
N$168  (via drill 1 pad 2)
  other vias: 7.62,12.7
N$169  (via drill 1 pad 2)
  other vias: 5.08,12.7
N$172  (via drill 1 pad 2)
  other vias: 5.08,10.16
N$173  (via drill 1 pad 2)
  other vias: 7.62,10.16
N$174  (via drill 1 pad 2)
  other vias: 10.16,10.16
N$175  (via drill 1 pad 2)
  other vias: 12.7,10.16
N$176  (via drill 1 pad 2)
  other vias: 15.24,10.16
N$178  (via drill 1 pad 2)
  other vias: 17.78,10.16
N$179  (via drill 1 pad 2)
  other vias: 20.32,10.16
N$180  (via drill 1 pad 2)
  other vias: 22.86,10.16
N$181  (via drill 1 pad 2)
  other vias: 22.86,7.62
N$182  (via drill 1 pad 2)
  other vias: 20.32,7.62
N$183  (via drill 1 pad 2)
  other vias: 17.78,7.62
N$184  (via drill 1 pad 2)
  other vias: 15.24,7.62
N$185  (via drill 1 pad 2)
  other vias: 12.7,7.62
N$187  (via drill 1 pad 2)
  other vias: 10.16,7.62
N$188  (via drill 1 pad 2)
  other vias: 7.62,7.62
N$189  (via drill 1 pad 2)
  other vias: 5.08,7.62
N$192  (via drill 1 pad 2)
  other vias: 5.08,5.08
N$193  (via drill 1 pad 2)
  other vias: 7.62,5.08
N$194  (via drill 1 pad 2)
  other vias: 10.16,5.08
N$197  (via drill 1 pad 2)
  other vias: 17.78,5.08
N$198  (via drill 1 pad 2)
  other vias: 20.32,5.08
N$199  (via drill 1 pad 2)
  other vias: 22.86,5.08
VCC  (via drill 0.8 pad 1.6, 1 pad 2)
  Top 0.61: v38.1,25.4 v31.75,19.05
  Bottom 0.61: IC1.7 46.99,28.68 | 46.99,28.68 46.99,24.13 | IC1.20 39.06,27.63 38.1,26.67 v38.1,25.4 | 65.09,1.27 65.41,1.59 65.41,1.91 65.41,3.81 63.5,5.71 63.5,6.35 | 65.09,1.27 64.77,0.95 | 37.88,15.02 R3.2 37.88,9.94 37.78,9.84 37.15,9.21 37.15,7.62 | 37.88,15.02 R2.2 34.51,16.29 v31.75,19.05 | 38.42,15.56 37.88,15.02 | 37.47,15.56 38.42,15.56 | v2.54,2.54 v5.08,2.54 v7.62,2.54 v10.16,2.54 10.48,2.54 10.79,2.86 13.02,5.08 14.92,5.08 17.14,2.86 17.14,2.54 v17.78,2.54 v20.32,2.54 v22.86,2.54 24.45,0.95 24.77,0.64 25.72,0.64 33.02,0.64 | 33.66,0.64 33.02,0.64 | 37.47,0.64 37.78,0.64 | 37.78,0.64 38.1,0.64 | 38.1,0.64 38.73,0.64 | 38.73,0.64 64.45,0.64 65.09,1.27 | 34.61,0.64 33.02,0.64 | 33.02,0.64 35.56,0.64 36.2,0.64 | 36.2,0.64 37.47,0.64 | 37.47,0.64 37.78,0.64 | 37.78,0.64 37.47,0.64 | 37.47,0.64 36.2,0.64 | 38.42,15.56 40.01,15.56 C4.1 | 37.15,7.62 37.15,6.99 | 37.15,6.99 37.15,6.93 37.15,6.35 | 37.15,6.35 37.15,5.4 37.15,4.76 38.1,3.81 PWR_.3 38.1,1.27 | C5.+ 37.2,7.04 37.15,6.99 | 37.15,7.62 37.78,6.99 37.15,6.35 | FTDI_.3 66.36,23.5 67.63,22.23 67.94,21.91 67.94,13.02 63.5,8.57 63.5,7.62 | 63.5,7.62 63.5,6.99 | 63.5,6.99 63.5,6.35 | 46.99,28.68 46.99,23.5 56.83,13.65 56.83,12.06 59.69,9.21 60.33,8.57 61.91,6.99 62.87,6.99 | 62.87,6.99 63.5,6.99 | 63.5,7.62 62.87,6.99 | 62.87,6.99 63.5,6.35 | 38.1,1.27 38.1,0.64 | 38.1,1.27 38.73,0.64 | 38.1,1.27 37.47,0.64

### Text on the board
Bottom: V. 1.1 | nanino rlx | FTDI | BY-NC-SA | CC